# EAGLE design LoadSwitches_(TPS2x) (EAGLE 7.1.0)
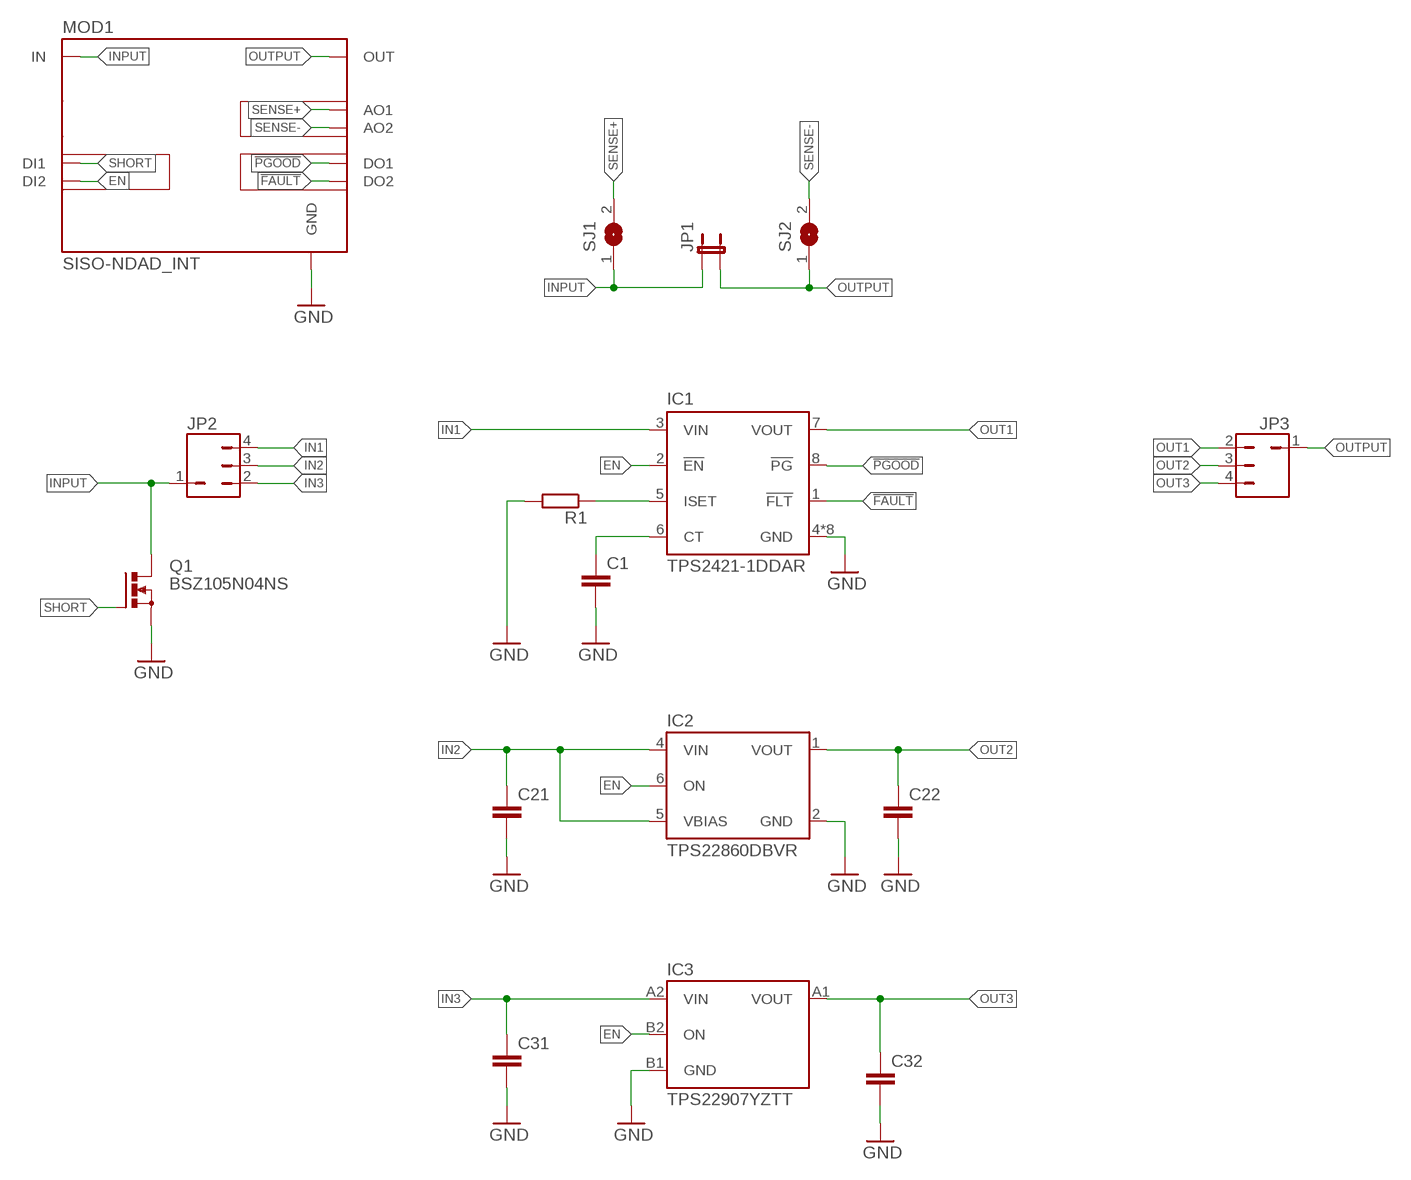
[diagram p0: schematic, sheet 1]

## Parts
C1  C-EUC0805  [C0805]
C21  C-EUC0805  [C0805]
C22  C-EUC0805  [C0805]
C31  C-EUC0805  [C0805]
C32  C-EUC0805  [C0805]
IC1  TPS2421-1DDAR  [HSOP8]
IC2  TPS22860DBVR  [SOT23-6]
IC3  TPS22907YZTT  [BGA4C50P2X2_90X90X63]
JP1  JP2_SMALL_PAD  [JP2_SMALL_PAD]
JP2  JP3Q  [JP1-3]
JP3  JP3Q  [JP1-3]
MOD1  SISO-NDAD_INT  [SISO-NDAD]
Q1  BSZ105N04NS  [PG-TDSON-8]
R1  R-EU_R0805  [R0805]
SJ1  SJ2  [SJ2]
SJ2  SJ2  [SJ2]

## Nets
!FAULT: IC1.1(!FLT) MOD1.DO2
!PGOOD: IC1.8(!PG) MOD1.DO1
EN: IC1.2(!EN) IC2.6(ON) IC3.B2(ON) MOD1.DI2
GND: C1.2 C21.2 C22.2 C31.2 C32.2 IC1.4(GND) IC1.EXP(GND) IC1.P$1(GND) IC1.P$2(GND) IC1.P$3(GND) IC1.P$4(GND) IC1.P$5(GND) IC1.P$6(GND) IC2.2(GND) IC3.B1(GND) MOD1.GND1(GND) MOD1.GND2(GND) MOD1.GND3(GND) MOD1.GND4(GND) Q1.1(S) Q1.2(S) Q1.3(S) R1.2
IN1: IC1.3(VIN) JP2.4
IN2: C21.1 IC2.4(VIN) IC2.5(VBIAS) JP2.3
IN3: C31.1 IC3.A2(VIN) JP2.2
INPUT: JP1.1 JP2.1 MOD1.IN1(IN) MOD1.IN2(IN) MOD1.IN3(IN) MOD1.IN4(IN) Q1.5(D) Q1.6(D) Q1.7(D) Q1.8(D) Q1.TH(D) SJ1.1
N$5: IC1.5(ISET) R1.1
N$6: C1.1 IC1.6(CT)
OUT1: IC1.7(VOUT) JP3.2
OUT2: C22.1 IC2.1(VOUT) JP3.3
OUT3: C32.1 IC3.A1(VOUT) JP3.4
OUTPUT: JP1.2 JP3.1 MOD1.OUT1_1(OUT) MOD1.OUT1_2(OUT) MOD1.OUT1_3(OUT) MOD1.OUT1_4(OUT) SJ2.1
SENSE+: MOD1.AO1 SJ1.2
SENSE-: MOD1.AO2 SJ2.2
SHORT: MOD1.DI1 Q1.4(G)

## Library data of the parts
C1 C21 C22 C31 C32 = rcl:C-EU: CAPACITOR, European symbol
IC1 = TPS2421:TPS2421-1DDAR: TI TPS2421-1 3-V to 20-V Integrated FET Hot Swap
IC2 = TPS22860:TPS22860DBVR
IC3 = TPS22907YZT:TPS22907YZTT: ULTRA SMALL, LOW-INPUT VOLTAGE, LOW rON LOAD SWITCH
JP1 = Jumper_mod:JP2_SMALL_PAD
JP2 JP3 = Jumper_mod:JP3Q
MOD1 = AllModules:SISO-NDAD_INT
Q1 = transistor-power:BSZ105N04NS: OptiMOS (TM)3 Power-Transistor N-Channel, Normal level Source : Data sheet <http://www.infineon.com/dgdl/BSZ105N04NSG_rev1.1.pdf?folderId=db3a3043156fd5730115c7d50620107c&fileId=db3a30431689f4420116c485c67f084e>
R1 = rcl:R-EU_: RESISTOR, European symbol
SJ1 SJ2 = Jumper_mod:SJ2: SMD solder JUMPER

## Board
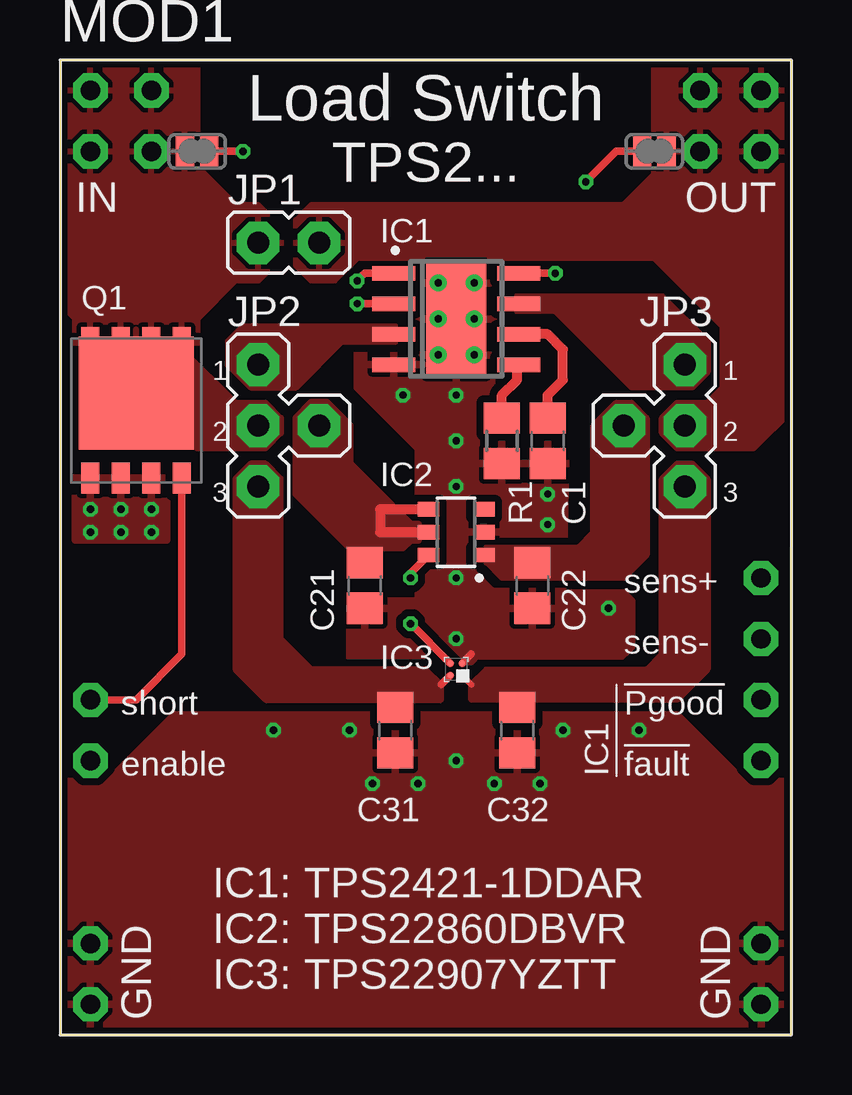
[diagram p1: board, top side]
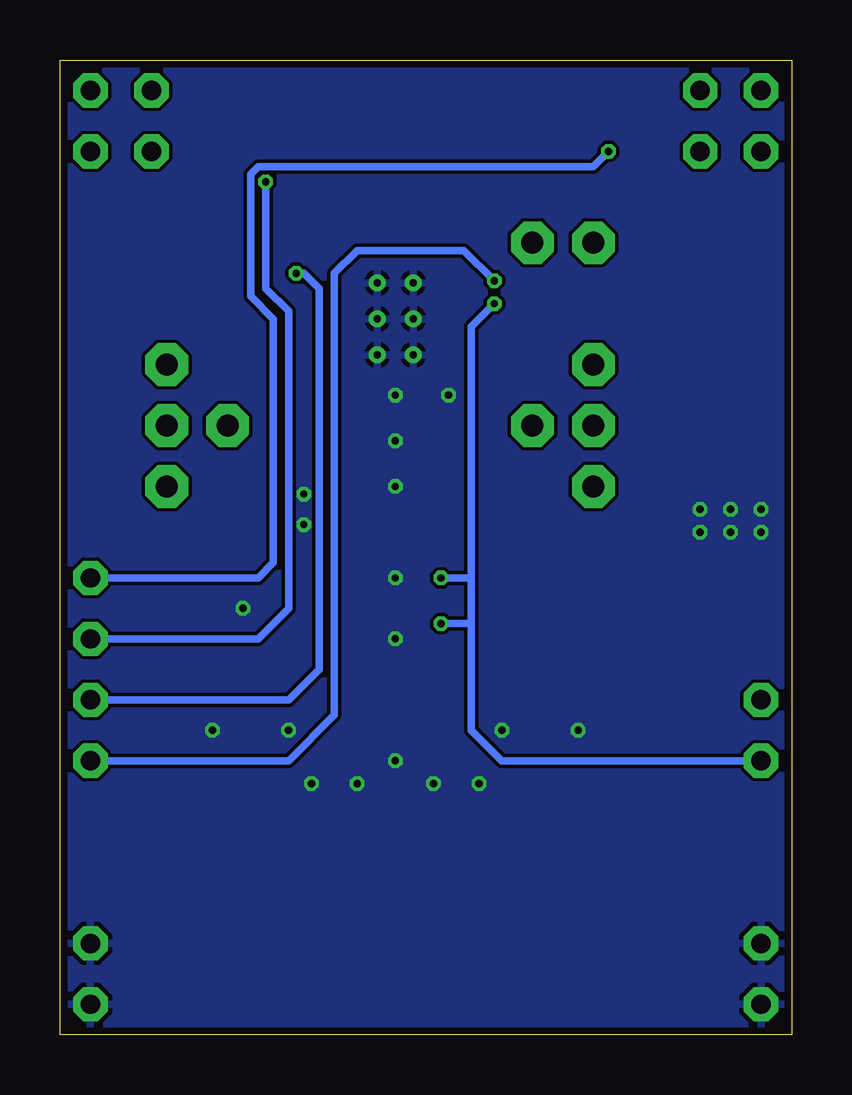
[diagram p2: board, bottom side, seen from below]

Size 30.48 x 40.64 mm. Coordinates in mm from the lower left corner, seen from the top.
Outline: 0,0 30.46,0 30.48,40.64 0,40.64 0,0
Copper layers (1*16): Top 0.035mm / dielectric 1.5mm / Bottom 0.035mm
Design rules "PCB-POOL Standard *": minimum track width 0.15mm, minimum drill 0.3mm, track to track 0.15mm, track to pad 0.15mm, pad to pad 0.15mm, via to via 0.15mm, smd to smd 0.15mm, copper to edge 0.3mm, drill to drill 0.2mm, minimum pad ring 0.2mm, minimum via ring 0.15mm, stop-mask expansion 0.075mm, vias tented up to drill 0mil, thermal gap 0.2mm

### Footprints (pad centres in the part's own frame; a part is rotated, then mirrored left to right if it is on the bottom)
C0805 = smd 1.3 x 1.5: 1 -0.95,0; 2 0.95,0
HSOP8 = smd 1.8 x 0.6: 1 -2.6,1.905; 2 -2.6,0.635; 3 -2.6,-0.635; 4 -2.6,-1.905; 5 2.6,-1.905; 6 2.6,-0.635; 7 2.6,0.635; 8 2.6,1.905 | smd 2.5 x 4.8: EXP 0,0 | drill 0.3: P$1 -0.75,-1.5; P$2 0.75,-1.5; P$3 0.75,0; P$4 -0.75,0; P$5 -0.75,1.5; P$6 0.75,1.5
SOT23-6 = smd 0.9 x 0.6: 1 -1.15,0.95; 2 -1.15,0; 3 -1.15,-0.95; 4 1.15,-0.95; 5 1.15,0; 6 1.15,0.95
BGA4C50P2X2_90X90X63 = smd 0.254 x 0.254: A1 0.246,-0.246; A2 -0.246,-0.246; B1 0.246,0.246; B2 -0.246,0.246
JP2_SMALL_PAD = drill 0.914 pad 1.778 octagon: 1 -2.54,0; 2 0,0
JP1-3 = drill 0.914 pad 1.778 octagon: 1 0,0; 2 0,2.54; 3 -2.54,0; 4 0,-2.54
SISO-NDAD = drill 0.8 pad 1.422 octagon: AO1 27.94,-20.32; AO2 27.94,-22.86; DI1 0,-25.4; DI2 0,-27.94; DO1 27.94,-25.4; DO2 27.94,-27.94; GND1 0,-38.1; GND2 0,-35.56; GND3 27.94,-35.56; GND4 27.94,-38.1; IN1 0,0; IN2 0,-2.54; IN3 2.54,0; IN4 2.54,-2.54; OUT1_1 25.4,0; OUT1_2 25.4,-2.54; OUT1_3 27.94,0; OUT1_4 27.94,-2.54
PG-TDSON-8 = smd 1.3 x 0.75: 1 -2.825,1.905; 2 -2.825,0.635; 3 -2.825,-0.635; 4 -2.825,-1.905; 5 2.825,-1.905; 6 2.825,-0.635; 7 2.825,0.635; 8 2.825,1.905 | smd 4.7 x 4.8: TH 0.725,0
R0805 = smd 1.3 x 1.5: 1 -0.95,0; 2 0.95,0
SJ2 = smd 0.762 x 1.27: 1 -0.508,0; 2 0.508,0

### Placement (x,y rotation side)
C1  20.32,24.77 270 top
C21  12.7,18.73 270 top
C22  19.68,18.73 270 top
C31  13.97,12.7 270 top
C32  19.05,12.7 270 top
IC1  16.51,29.84 0 top
IC2  16.51,20.95 180 top
IC3  16.51,15.24 0 top
JP1  10.79,33.02 0 top
JP2  8.26,25.4 180 top
JP3  26.04,25.4 0 top
MOD1  1.27,39.37 0 top
Q1  3.17,26.04 90 top
R1  18.41,24.77 270 top
SJ1  5.71,36.83 0 top
SJ2  24.77,36.83 180 top

### Tracks (layer width: path | path; a pad name or v marks a point on that pad's centre or on a via)
!FAULT  (via drill 0.3)
  Top 0.305: v12.38,31.43 12.7,31.75 IC1.1
  Bottom 0.305: MOD1.DO2 20.95,11.43 19.05,13.34 19.05,31.75 18.1,32.7 13.65,32.7 v12.38,31.43
!PGOOD  (via drill 0.3)
  Top 0.305: IC1.8 v20.64,31.75
  Bottom 0.305: MOD1.DO1 20.95,13.97 19.68,15.24 19.68,31.11 20.32,31.75 v20.64,31.75
EN  (via drill 0.3)
  Top 0.305: v14.61,17.14 IC3.B2 | v12.38,30.48 IC1.2 | v14.61,19.05 14.61,19.25 IC2.6
  Bottom 0.305: 13.34,17.14 13.34,12.7 12.06,11.43 MOD1.DI2 | 13.34,17.14 13.34,19.05 | 13.34,19.05 13.34,29.53 v12.38,30.48 | v14.61,17.14 13.34,17.14 | v14.61,19.05 13.34,19.05
GND  (via drill 0.3)
  Top 0.305: IC3.B1 17.14,15.88
  other vias: 3.81,20.95 2.54,20.95 1.27,20.95 1.27,21.91 2.54,21.91 3.81,21.91 20,10.48 18.1,10.48 14.92,10.48 13.02,10.48 16.51,11.43 16.51,16.51 16.51,19.05 16.51,22.86 20.32,22.54 16.51,26.67 14.29,26.67 16.51,24.77 20.95,12.7 8.89,12.7 20.32,21.27 22.86,17.78 12.06,12.7 24.13,12.7
  pour Top (isolate 0.305, rank 2): 12.38,32.38 21.27,32.38 20.95,18.41 23.5,18.41 23.81,18.1 23.81,16.19 23.18,15.56 12.06,15.56 12.06,18.1 14.92,18.1 14.92,24.45 12.38,26.99
  pour Bottom: -1.27,41.91 31.75,41.91 31.75,-1.27 -1.27,-1.27
  pour Top (isolate 0.305, rank 2): 0.64,23.5 4.45,23.5 4.45,20.64 0.64,20.64
  pour Top (isolate 0.305, rank 2): 0,10.79 2.22,10.79 4.76,13.34 25.72,13.34 28.26,10.79 30.48,10.79 30.48,0 0,0
IN1
  pour Top (no thermals): 7.94,26.99 9.84,26.99 11.75,28.89 13.97,28.89 13.97,29.53 7.62,29.53 6.99,28.89 6.99,27.94
IN2
  Top 0.406: IC2.4 13.34,21.91 | 13.34,21.91 | 13.34,21.91 13.34,20.95 IC2.5
  pour Top (no thermals): 9.84,22.54 9.84,25.72 10.48,26.35 11.11,26.35 12.06,25.4 12.06,23.81 14.61,21.27 14.92,21.27 14.92,20.64 14.61,20.64 14.29,20.32 12.06,20.32
IN3
  Top 0.305: IC3.A2 15.88,14.61
  pour Top (no thermals): 15.88,14.61 15.24,15.24 10.48,15.24 9.21,16.51 9.21,23.18 8.57,23.81 7.94,23.81 7.3,23.18 7.3,15.24 8.57,13.97 15.88,13.97
INPUT
  pour Top (no thermals): 1.27,24.77 1.27,28.57 5.08,28.57 7.3,26.35 8.57,26.35 9.21,25.72 9.21,25.08 8.57,24.45 5.71,24.45 5.4,24.77
  pour Top: 0.64,28.57 0.64,29.84 0,30.48 0,40.64 5.71,40.64 5.71,36.2 7.3,34.61 8.26,34.61 9.21,33.66 9.21,32.38 8.26,31.43 7.3,31.43 5.71,29.84 5.71,28.57
N$5
  Top 0.406: R1.1 18.41,26.67 19.05,27.3 19.05,27.88 IC1.5
N$6
  Top 0.406: C1.1 20.32,26.67 20.95,27.3 20.95,28.57 20.32,29.21 IC1.6
OUT1
  pour Top (no thermals): 19.05,30.16 19.05,30.8 25.08,30.8 26.99,28.89 26.99,27.62 26.35,26.99 23.81,26.99 20.64,30.16
OUT2
  pour Top (no thermals): 17.78,20.32 21.59,20.32 22.23,20.95 22.23,25.4 23.18,26.35 23.81,26.35 24.45,25.72 24.45,20 23.5,19.05 18.41,19.05 17.78,19.68
OUT3
  Top 0.254: IC3.A1 17.14,14.61
  pour Top (no thermals): 17.14,14.61 17.78,15.24 24.45,15.24 25.08,15.88 25.08,23.18 25.72,23.81 26.35,23.81 26.99,23.18 26.99,15.24 25.72,13.97 17.14,13.97
OUTPUT
  pour Top (no thermals): 24.45,32.7 30.48,32.7 30.48,26.04 28.89,24.45 25.72,24.45 25.08,25.08 25.08,25.72 25.72,26.35 26.99,26.35 27.62,26.99 27.62,29.53
  pour Top: 24.77,40.64 30.48,40.64 30.48,32.38 12.38,32.38 11.43,31.43 10.48,31.43 9.84,32.07 9.84,33.97 10.48,34.61 23.5,34.61 24.77,35.88
SENSE+  (via drill 0.3)
  Top 0.305: v7.62,36.83 SJ1.2
  Bottom 0.305: MOD1.AO1 22.23,19.05 21.59,19.68 21.59,29.84 22.54,30.8 22.54,35.88 22.23,36.2 8.26,36.2 v7.62,36.83
SENSE-  (via drill 0.3)
  Top 0.305: SJ2.2 23.18,36.83 v21.91,35.56
  Bottom 0.305: MOD1.AO2 22.23,16.51 20.95,17.78 20.95,30.16 21.91,31.11 v21.91,35.56
SHORT
  Top 0.305: Q1.4 5.08,15.88 3.17,13.97 MOD1.DI1

### Text on the board
tNames: Load Switch | TPS2... | 1 | 1 | 2 | 2 | 3 | 3 | sens+ | sens- | short | !Pgood | enable | IC1 | !fault | IC1: | IC2: | IC3:
bStop: Kokert & Younesi / 26.01.2016